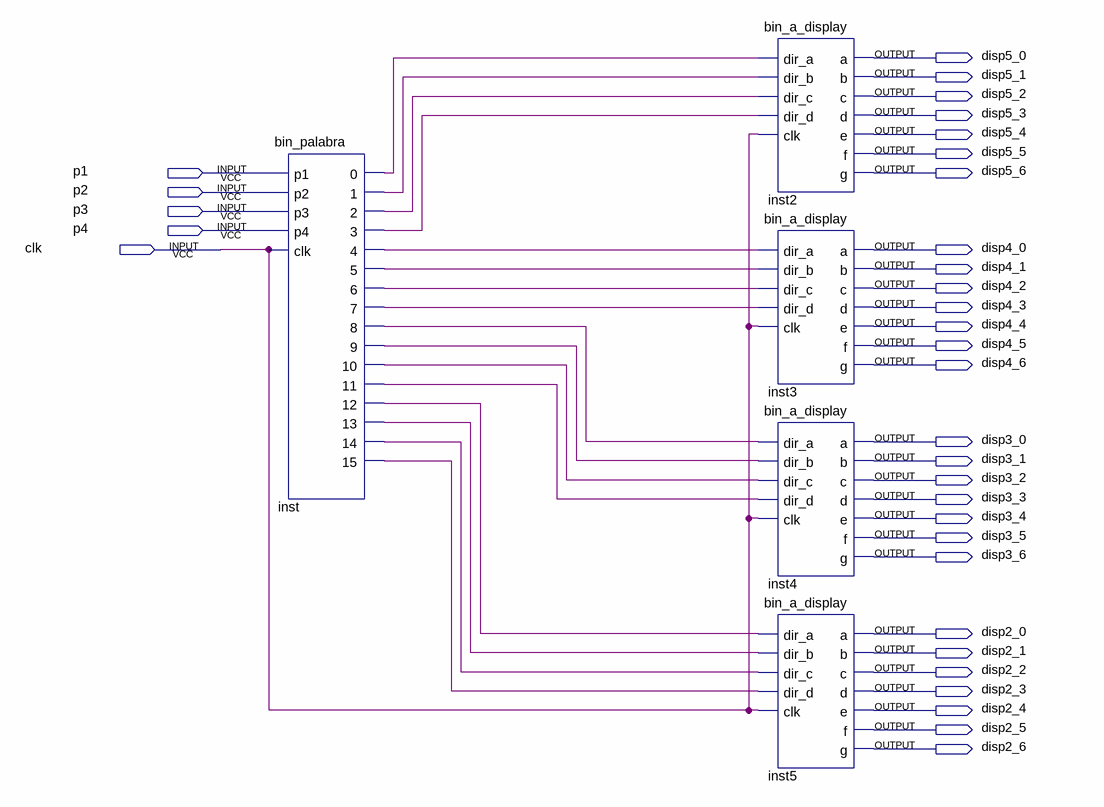
[diagram p0: schematic sheet]
// Quartus schematic mostrar_palabras.bdf as structural Verilog: 5 symbols, 33 pins
module mostrar_palabras (
  input  p1,
  input  p2,
  input  p3,
  input  p4,
  input  clk,
  output disp5_0,
  output disp5_1,
  output disp5_2,
  output disp5_3,
  output disp5_4,
  output disp5_5,
  output disp5_6,
  output disp4_0,
  output disp4_1,
  output disp4_2,
  output disp4_3,
  output disp4_4,
  output disp4_5,
  output disp4_6,
  output disp3_0,
  output disp3_1,
  output disp3_2,
  output disp3_3,
  output disp3_4,
  output disp3_5,
  output disp3_6,
  output disp2_0,
  output disp2_1,
  output disp2_2,
  output disp2_3,
  output disp2_4,
  output disp2_5,
  output disp2_6
);

  wire inst_0, inst_1, inst_2, inst_3, inst_4, inst_5, inst_6, inst_7, inst_8, inst_9, inst_10, inst_11,
       inst_12, inst_13, inst_14, inst_15;

  bin_palabra inst (
    .p1(p1), .p2(p2), .p3(p3), .p4(p4), .clk(clk), .\0 (inst_0), .\1 (inst_1), .\2 (inst_2), .\3 (inst_3),
    .\4 (inst_4), .\5 (inst_5), .\6 (inst_6), .\7 (inst_7), .\8 (inst_8), .\9 (inst_9), .\10 (inst_10),
    .\11 (inst_11), .\12 (inst_12), .\13 (inst_13), .\14 (inst_14), .\15 (inst_15));
  bin_a_display inst2 (
    .dir_a(inst_0), .dir_b(inst_1), .dir_c(inst_2), .dir_d(inst_3), .clk(clk), .a(disp5_0), .b(disp5_1),
    .c(disp5_2), .d(disp5_3), .e(disp5_4), .f(disp5_5), .g(disp5_6));
  bin_a_display inst3 (
    .dir_a(inst_4), .dir_b(inst_5), .dir_c(inst_6), .dir_d(inst_7), .clk(clk), .a(disp4_0), .b(disp4_1),
    .c(disp4_2), .d(disp4_3), .e(disp4_4), .f(disp4_5), .g(disp4_6));
  bin_a_display inst4 (
    .dir_a(inst_8), .dir_b(inst_9), .dir_c(inst_10), .dir_d(inst_11), .clk(clk), .a(disp3_0), .b(disp3_1),
    .c(disp3_2), .d(disp3_3), .e(disp3_4), .f(disp3_5), .g(disp3_6));
  bin_a_display inst5 (
    .dir_a(inst_12), .dir_b(inst_13), .dir_c(inst_14), .dir_d(inst_15), .clk(clk), .a(disp2_0), .b(disp2_1),
    .c(disp2_2), .d(disp2_3), .e(disp2_4), .f(disp2_5), .g(disp2_6));
endmodule
